# EAGLE schematic psoc1_20246_A (EAGLE 7.2.0)
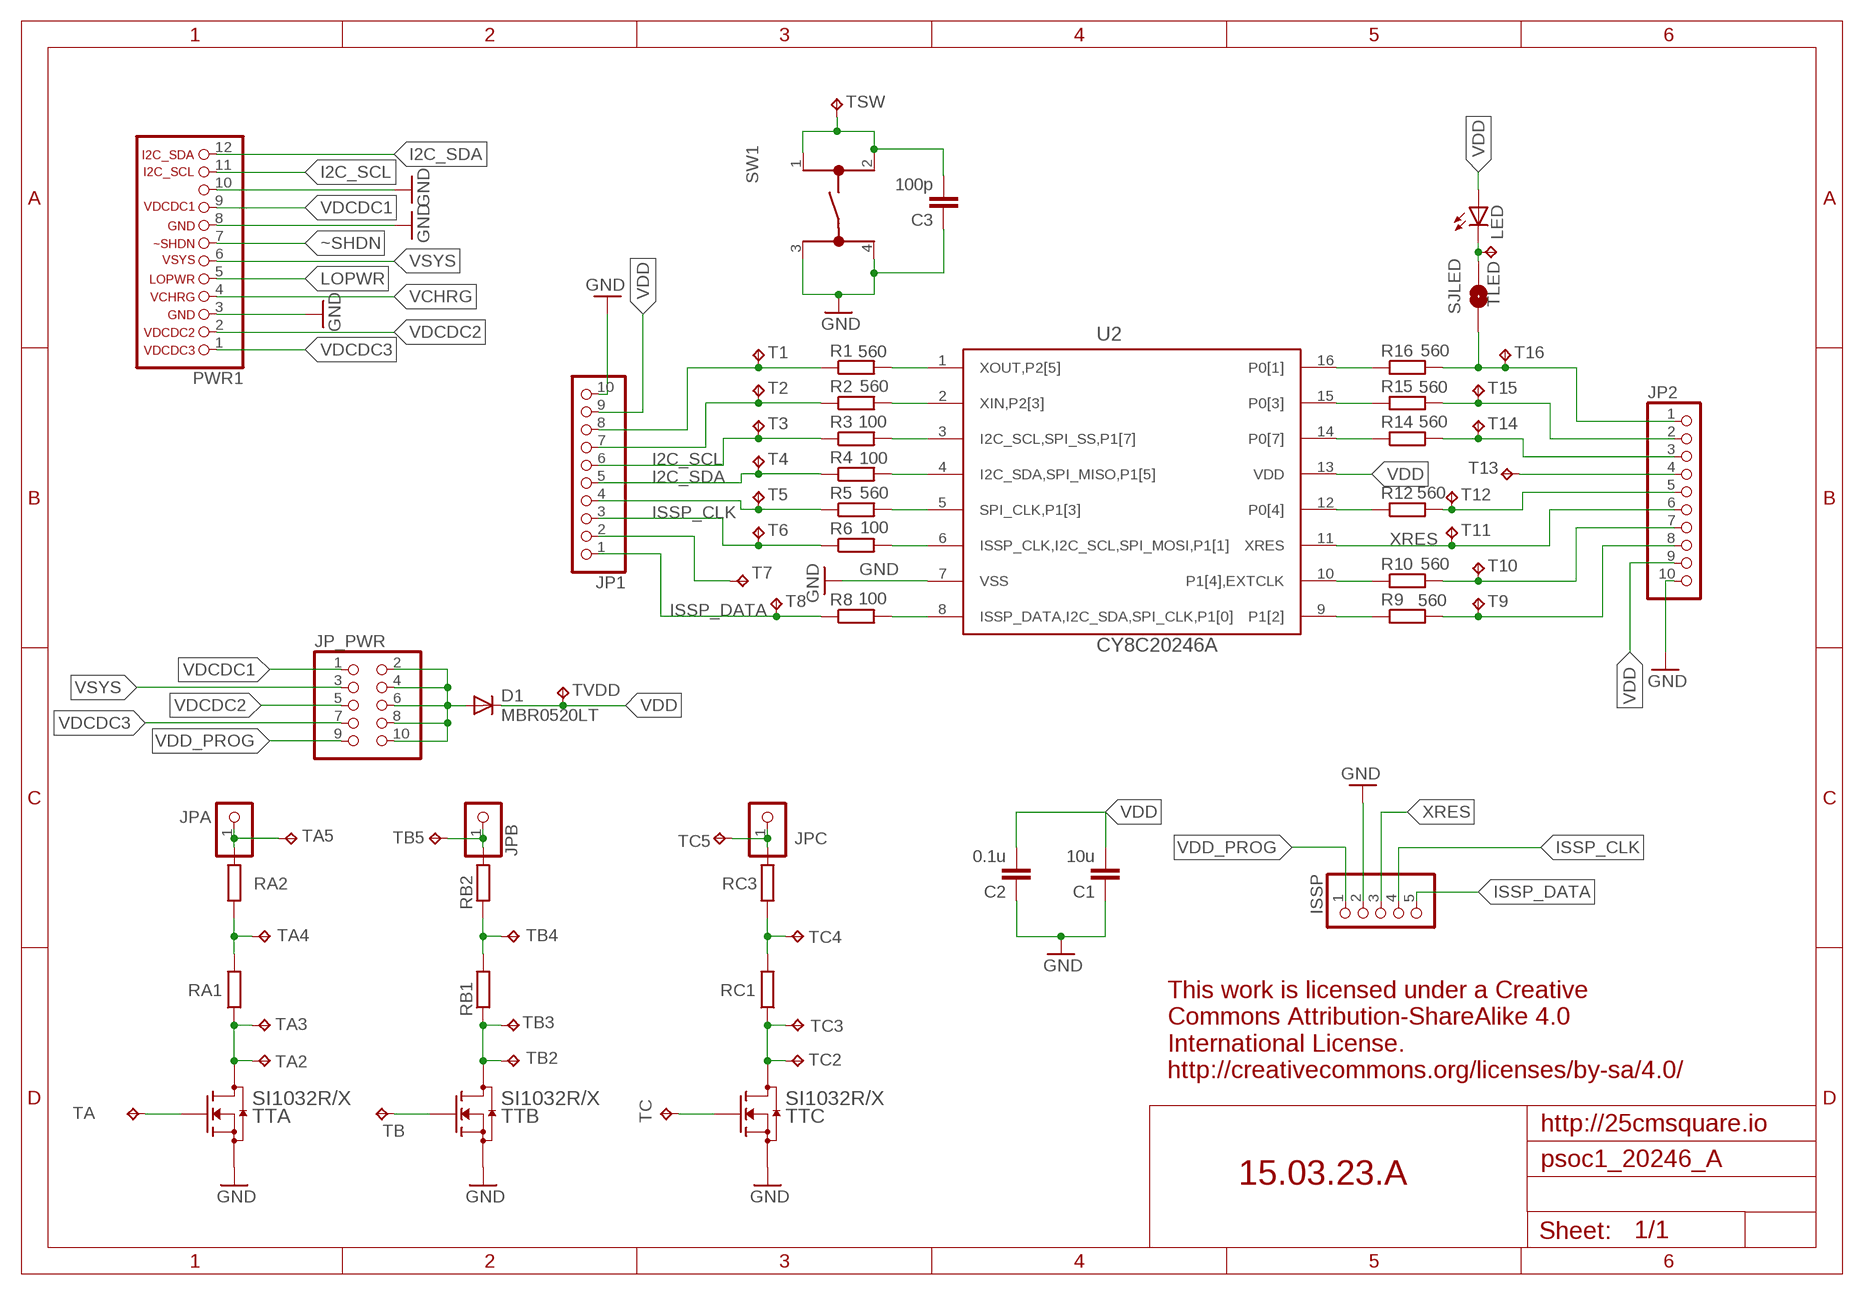
[diagram p0: schematic, sheet 1]

## Parts
C1  10u  C-EUC1206  [C1206]
C2  0.1u  C-EUC0603  [C0603]
C3  100p  C-EUC0603  [C0603]
D1  MBR0520LT  [SOD123]
ISSP  PINHD-1X5/90  [1X05/90]
JP1  PINHD-1X10  [1X10]
JP2  PINHD-1X10  [1X10]
JP_PWR  PINHD-2X5  [2X05]
JPA  PINHD-1X1  [1X01]
JPB  PINHD-1X1  [1X01]
JPC  PINHD-1X1  [1X01]
LED  LEDSML0603  [SML0603]
PWR1  LIWE_12_PIN_PWR  [LIWE_12_PIN]
R1  560  R-EU_R0603  [R0603]
R2  560  R-EU_R0603  [R0603]
R3  100  R-EU_R0603  [R0603]
R4  100  R-EU_R0603  [R0603]
R5  560  R-EU_R0603  [R0603]
R6  100  R-EU_R0603  [R0603]
R8  100  R-EU_R0603  [R0603]
R9  560  R-EU_R0603  [R0603]
R10  560  R-EU_R0603  [R0603]
R12  560  R-EU_R0603  [R0603]
R14  560  R-EU_R0603  [R0603]
R15  560  R-EU_R0603  [R0603]
R16  560  R-EU_R0603  [R0603]
RA1  R-EU_R0603  [R0603]
RA2  R-EU_R0603  [R0603]
RB1  R-EU_R0603  [R0603]
RB2  R-EU_R0603  [R0603]
RC1  R-EU_R0603  [R0603]
RC3  R-EU_R0603  [R0603]
SJLED  SOLDERJUMPERNO  [SJ_2S-NO]
SW1  FSM4JH  [FSM4JH]
T1  TPTP14R  [TP14R]
T2  TPTP14R  [TP14R]
T3  TPTP14R  [TP14R]
T4  TPTP14R  [TP14R]
T5  TPTP14R  [TP14R]
T6  TPTP14R  [TP14R]
T7  TPTP14R  [TP14R]
T8  TPTP14R  [TP14R]
T9  TPTP14R  [TP14R]
T10  TPTP14R  [TP14R]
T11  TPTP14R  [TP14R]
T12  TPTP14R  [TP14R]
T13  TPTP14R  [TP14R]
T14  TPTP14R  [TP14R]
T15  TPTP14R  [TP14R]
T16  TPTP14R  [TP14R]
TA  TPTP14R  [TP14R]
TA2  TPTP14R  [TP14R]
TA3  TPTP14R  [TP14R]
TA4  TPTP14R  [TP14R]
TA5  TPTP14R  [TP14R]
TB  TPTP14R  [TP14R]
TB2  TPTP14R  [TP14R]
TB3  TPTP14R  [TP14R]
TB4  TPTP14R  [TP14R]
TB5  TPTP14R  [TP14R]
TC  TPTP14R  [TP14R]
TC2  TPTP14R  [TP14R]
TC3  TPTP14R  [TP14R]
TC4  TPTP14R  [TP14R]
TC5  TPTP14R  [TP14R]
TLED  TPTP14R  [TP14R]
TSW  TPTP14R  [TP14R]
TTA  SI1032R/X  [SC-75A]
TTB  SI1032R/X  [SC-75A]
TTC  SI1032R/X  [SC-75A]
TVDD  TPTP14R  [TP14R]
U2  CY8C20246A  [QFN16_3X3_NOEPAD]

## Nets
GND: C1.1 C2.1 C3.1 ISSP.2 JP1.10 JP2.10 PWR1.3 PWR1.8 PWR1.10 SW1.3 SW1.4 TTA.S TTB.S TTC.S U2.7(VSS)
I2C_SCL: JP1.6 PWR1.11 R3.1 T3.TP
I2C_SDA: JP1.5 PWR1.12 R4.1 T4.TP
ISSP_CLK: ISSP.4 JP1.3 R6.1 T6.TP
ISSP_DATA: ISSP.5 JP1.1 R8.1 T8.TP
LOPWR: PWR1.5
N$1: JP1.8 R1.1 T1.TP
N$2: JP1.7 R2.1 T2.TP
N$3: RB1.1 TB2.TP TB3.TP TTB.D
N$4: RB1.2 RB2.1 TB4.TP
N$5: JP1.4 R5.1 T5.TP
N$6: D1.A JP_PWR.2 JP_PWR.4 JP_PWR.6 JP_PWR.8 JP_PWR.10
N$7: R1.2 U2.1(XOUT,P2[5])
N$8: R2.2 U2.2(XIN,P2[3])
N$9: JP2.1 R16.2 SJLED.1 T16.TP
N$10: JP2.2 R15.2 T15.TP
N$11: JP2.3 R14.2 T14.TP
N$12: R3.2 U2.3(I2C_SCL,SPI_SS,P1[7])
N$13: JP2.5 R12.2 T12.TP
N$14: R4.2 U2.4(I2C_SDA,SPI_MISO,P1[5])
N$15: JP2.7 R10.2 T10.TP
N$16: JP2.8 R9.2 T9.TP
N$17: R5.2 U2.5(SPI_CLK,P1[3])
N$18: R6.2 U2.6(ISSP_CLK,I2C_SCL,SPI_MOSI,P1[1])
N$19: R8.2 U2.8(ISSP_DATA,I2C_SDA,SPI_CLK,P1[0])
N$20: R16.1 U2.16(P0[1])
N$21: R15.1 U2.15(P0[3])
N$22: R14.1 U2.14(P0[7])
N$23: R12.1 U2.12(P0[4])
N$24: JPB.1 RB2.2 TB5.TP
N$25: R10.1 U2.10(P1[4],EXTCLK)
N$26: R9.1 U2.9(P1[2])
N$27: TB.TP TTB.G
N$28: RA1.1 TA2.TP TA3.TP TTA.D
N$29: RA1.2 RA2.1 TA4.TP
N$30: JPA.1 RA2.2 TA5.TP
N$31: TA.TP TTA.G
N$32: RC1.1 TC2.TP TC3.TP TTC.D
N$33: RC1.2 RC3.1 TC4.TP
N$34: JPC.1 RC3.2 TC5.TP
N$35: TC.TP TTC.G
N$36: C3.2 SW1.1 SW1.2 TSW.TP
N$37: LED.C SJLED.2 TLED.TP
N$38: JP2.4 T13.TP
N$39: JP1.2 T7.TP
VCHRG: PWR1.4
VDCDC1: JP_PWR.1 PWR1.9
VDCDC2: JP_PWR.5 PWR1.2
VDCDC3: JP_PWR.7 PWR1.1
VDD: C1.2 C2.2 D1.C JP1.9 JP2.9 LED.A TVDD.TP U2.13(VDD)
VDD_PROG: ISSP.1 JP_PWR.9
VSYS: JP_PWR.3 PWR1.6
XRES: ISSP.3 JP2.6 T11.TP U2.11(XRES)
~SHDN: PWR1.7

## Notes on the sheet
- This work is licensed under a Creative
  Commons Attribution-ShareAlike 4.0
  International License.
  http://creativecommons.org/licenses/by-sa/4.0/
- http://25cmsquare.io
- 15.03.23.A

## Library data of the parts
C1 = rcl:C-EU: CAPACITOR, European symbol
C2 C3 = resistor:C-EU: CAPACITOR, European symbol; SPICEPREFIX: C
D1 = diode:MBR0520LT: SCHOTTKY BARRIER RECTIFIER Source: http://onsemi.com .. MBR0520LT1-D.pdf
ISSP = pinhead:PINHD-1X5: PIN HEADER
JP1 JP2 = pinhead:PINHD-1X10: PIN HEADER
JP_PWR = pinhead:PINHD-2X5: PIN HEADER
JPA JPB JPC = pinhead:PINHD-1X1: PIN HEADER
LED = led:LED: LED OSRAM: - CHIPLED LG R971, LG N971, LY N971, LG Q971, LY Q971, LO R971, LY R971 LH N974, LH R974 LS Q976, LO Q976, LY Q976 LO Q996 - Hyper CHIPLED LW Q18S LB Q993, LB Q99A, LB R99A - SideLED LS A670, LO A670, LY A670, LG A670, LP A670 LB A673, LV A673, LT A673, LW A673 LH A674 LY A675 LS A676, LA A676, LO A676, LY A676, LW A676 LS A679, LY A679, LG A679 - Hyper Micro SIDELED® LS Y876, LA Y876, LO Y876, LY Y876 LT Y87S - SmartLED LW L88C, LW L88S LB L89C, LB L89S, LG L890 LS L89K, LO L89K, LY L89K LS L896, LA L896, LO L896, LY L896 - TOPLED LS T670, LO T670, LY T670, LG T670, LP T670 LSG T670, LSP T670, LSY T670, LOP T670, LYG T670 LG T671, LOG T671, LSG T671 LB T673, LV T673, LT T673, LW T673 LH T674 LS T676, LA T676, LO T676, LY T676, LB T676, LH T676, LSB T676, LW T676 LB T67C, LV T67C, LT T67C, LS T67K, LO T67K, LY T67K, LW E67C LS E67B, LA E67B, LO E67B, LY E67B, LB E67C, LV E67C, LT E67C LW T67C LS T679, LY T679, LG T679 LS T770, LO T770, LY T770, LG T770, LP T770 LB T773, LV T773, LT T773, LW T773 LH T774 LS E675, LA E675, LY E675, LS T675 LS T776, LA T776, LO T776, LY T776, LB T776 LHGB T686 LT T68C, LB T68C - Hyper Mini TOPLED® LB M676 - Mini TOPLED Santana® LG M470 LS M47K, LO M47K, LY M47K Source: http://www.osram.convergy.de LUXEON: - LUMILED® LXK2-PW12-R00, LXK2-PW12-S00, LXK2-PW14-U00, LXK2-PW14-V00 LXK2-PM12-R00, LXK2-PM12-S00, LXK2-PM14-U00 LXK2-PE12-Q00, LXK2-PE12-R00, LXK2-PE12-S00, LXK2-PE14-T00, LXK2-PE14-U00 LXK2-PB12-K00, LXK2-PB12-L00, LXK2-PB12-M00, LXK2-PB14-N00, LXK2-PB14-P00, LXK2-PB14-Q00 LXK2-PR12-L00, LXK2-PR12-M00, LXK2-PR14-Q00, LXK2-PR14-R00 LXK2-PD12-Q00, LXK2-PD12-R00, LXK2-PD12-S00 LXK2-PH12-R00, LXK2-PH12-S00 LXK2-PL12-P00, LXK2-PL12-Q00, LXK2-PL12-R00 Source: www.luxeon.com KINGBRIGHT: KA-3528ASYC Source: www.kingbright.com
PWR1 = pma:LIWE_12_PIN_PWR
R1-R6 R8-R10 R12 R14-R16 RA1 RA2 RB1 RB2 RC1 RC3 = resistor:R-EU_: RESISTOR, European symbol; SPICEPREFIX: R
SJLED = SparkFun-Passives:SOLDERJUMPER: Solder Jumper Standard SMD solder jumper. Used to automate production. Two varients : Normally Open and Normally Closed are the same, but have different paste layers. NC will have a large amount of paste and should jumper during reflow.
SW1 = pma:FSM4JH: FSM4JH TE CONNECTIVITY / ALCOSWITCH http://sk.farnell.com/te-connectivity-alcoswitch/fsm4jh/switch-spno-0-05a/dp/1555982
T1-T16 TA TA2-TA5 TB TB2-TB5 TC TC2-TC5 TLED TSW TVDD = testpad:TP: Test pad
TTA TTB TTC = Vishay_By_element14_Batch_1:SI1032R/X: SI1032R/X http://www.vishay.com/docs/71172/si1032r.pdf http://sk.farnell.com/vishay-siliconix/si1032r-t1-ge3/mosfet-n-ch-20v-5ohm-0-14a-sc/dp/2335272
U2 = pma:CY8C20246A: CY8C20246A 1.8 V Programmable CapSense® Controller with SmartSense™ Auto-tuning 1–33 Buttons, 0–6 Sliders http://www.cypress.com/?docID=46872